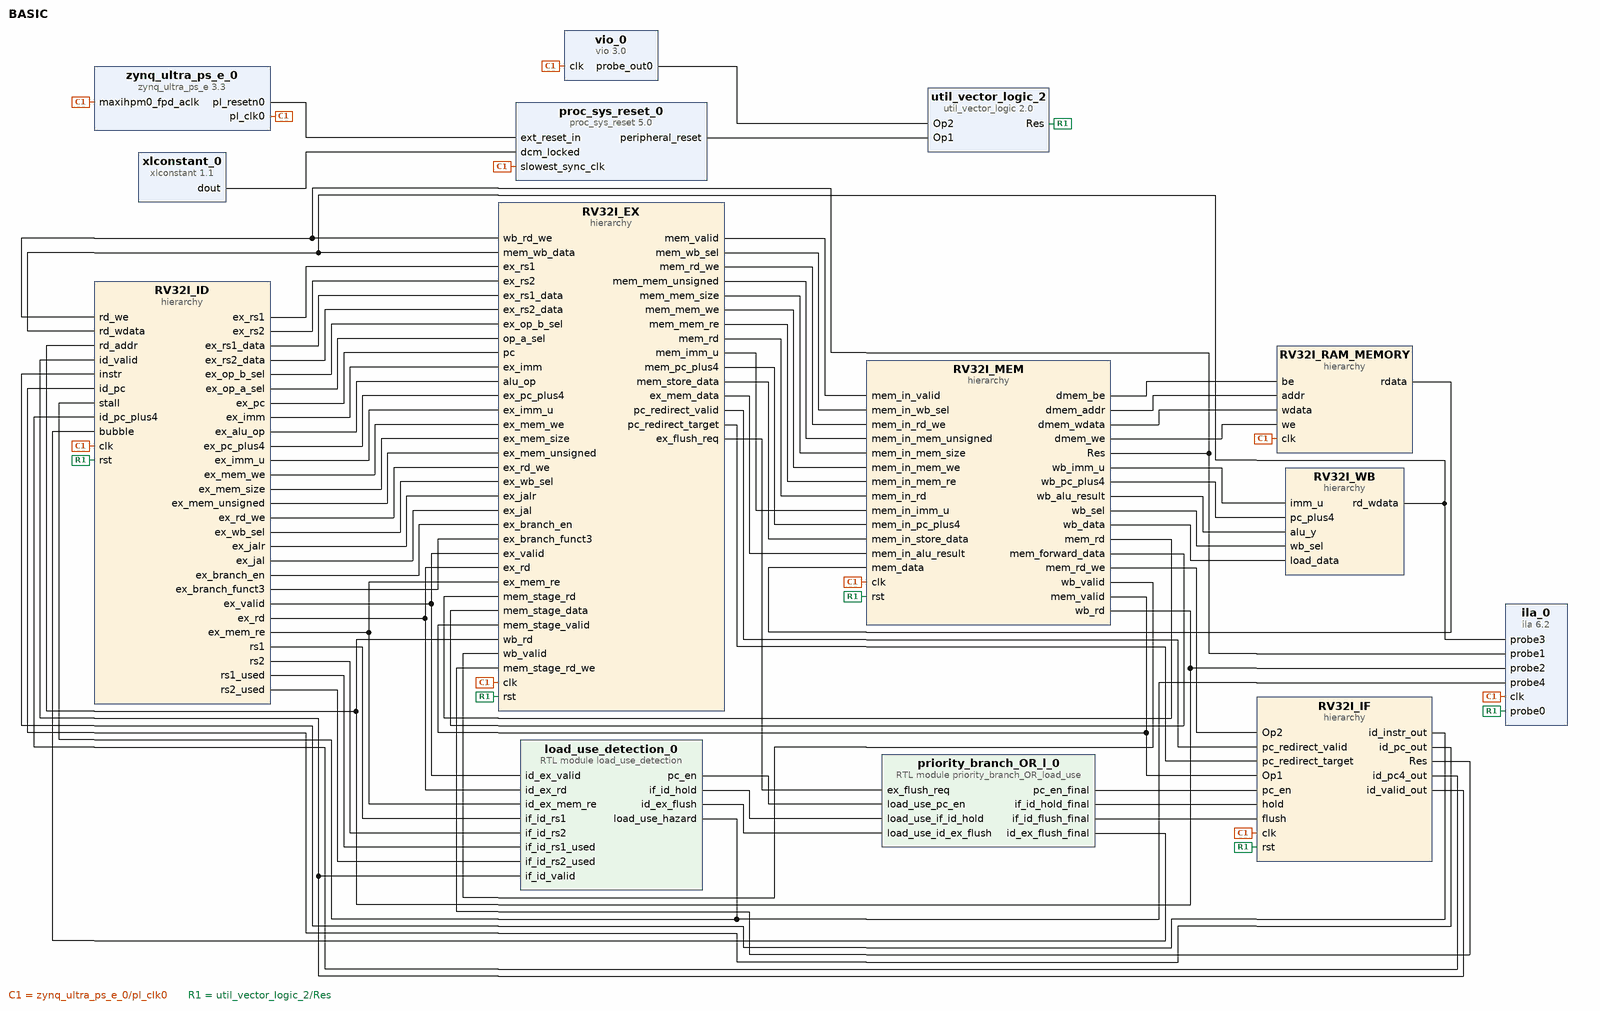
[diagram p0: block diagram of the top level]
# Vivado block design BASIC, xczu5ev-sfvc784-2-i, Vivado 2020.1
create_bd_design BASIC

create_bd_cell -type ip -vlnv xilinx.com:ip:zynq_ultra_ps_e:3.3 zynq_ultra_ps_e_0
set_property -dict [list \
  CONFIG.CAN0_BOARD_INTERFACE custom \
  CONFIG.CAN1_BOARD_INTERFACE custom \
  CONFIG.CSU_BOARD_INTERFACE custom \
  CONFIG.DP_BOARD_INTERFACE custom \
  CONFIG.GEM0_BOARD_INTERFACE custom \
  CONFIG.GEM1_BOARD_INTERFACE custom \
  CONFIG.GEM2_BOARD_INTERFACE custom \
  CONFIG.GEM3_BOARD_INTERFACE custom \
  CONFIG.GPIO_BOARD_INTERFACE custom \
  CONFIG.IIC0_BOARD_INTERFACE custom \
  CONFIG.IIC1_BOARD_INTERFACE custom \
  CONFIG.NAND_BOARD_INTERFACE custom \
  CONFIG.PCIE_BOARD_INTERFACE custom \
  CONFIG.PJTAG_BOARD_INTERFACE custom \
  CONFIG.PMU_BOARD_INTERFACE custom \
  CONFIG.PSU_BANK_0_IO_STANDARD LVCMOS18 \
  CONFIG.PSU_BANK_1_IO_STANDARD LVCMOS18 \
  CONFIG.PSU_BANK_2_IO_STANDARD LVCMOS18 \
  CONFIG.PSU_BANK_3_IO_STANDARD LVCMOS18 \
  CONFIG.PSU_USB3__DUAL_CLOCK_ENABLE 1 \
  CONFIG.PSU__CAN0__PERIPHERAL__ENABLE 1 \
  CONFIG.PSU__CAN0__PERIPHERAL__IO EMIO \
  CONFIG.PSU__CAN1__PERIPHERAL__ENABLE 0 \
  CONFIG.PSU__CRF_APB__ACPU_CTRL__FREQMHZ 1200 \
  CONFIG.PSU__CRF_APB__ACPU_CTRL__SRCSEL APLL \
  CONFIG.PSU__CRF_APB__APLL_CTRL__SRCSEL PSS_REF_CLK \
  CONFIG.PSU__CRF_APB__DBG_FPD_CTRL__FREQMHZ 250 \
  CONFIG.PSU__CRF_APB__DBG_FPD_CTRL__SRCSEL IOPLL \
  CONFIG.PSU__CRF_APB__DBG_TRACE_CTRL__FREQMHZ 250 \
  CONFIG.PSU__CRF_APB__DBG_TRACE_CTRL__SRCSEL IOPLL \
  CONFIG.PSU__CRF_APB__DBG_TSTMP_CTRL__FREQMHZ 250 \
  CONFIG.PSU__CRF_APB__DBG_TSTMP_CTRL__SRCSEL IOPLL \
  CONFIG.PSU__CRF_APB__DDR_CTRL__FREQMHZ 1200 \
  CONFIG.PSU__CRF_APB__DDR_CTRL__SRCSEL DPLL \
  CONFIG.PSU__CRF_APB__DPDMA_REF_CTRL__FREQMHZ 600 \
  CONFIG.PSU__CRF_APB__DPDMA_REF_CTRL__SRCSEL DPLL \
  CONFIG.PSU__CRF_APB__DPLL_CTRL__SRCSEL PSS_REF_CLK \
  CONFIG.PSU__CRF_APB__DP_AUDIO_REF_CTRL__SRCSEL RPLL \
  CONFIG.PSU__CRF_APB__DP_STC_REF_CTRL__SRCSEL RPLL \
  CONFIG.PSU__CRF_APB__DP_VIDEO_REF_CTRL__SRCSEL VPLL \
  CONFIG.PSU__CRF_APB__GDMA_REF_CTRL__FREQMHZ 600 \
  CONFIG.PSU__CRF_APB__GDMA_REF_CTRL__SRCSEL DPLL \
  CONFIG.PSU__CRF_APB__GPU_REF_CTRL__FREQMHZ 600 \
  CONFIG.PSU__CRF_APB__GPU_REF_CTRL__SRCSEL DPLL \
  CONFIG.PSU__CRF_APB__TOPSW_LSBUS_CTRL__FREQMHZ 100 \
  CONFIG.PSU__CRF_APB__TOPSW_LSBUS_CTRL__SRCSEL IOPLL \
  CONFIG.PSU__CRF_APB__TOPSW_MAIN_CTRL__FREQMHZ 533.333 \
  CONFIG.PSU__CRF_APB__TOPSW_MAIN_CTRL__SRCSEL DPLL \
  CONFIG.PSU__CRF_APB__VPLL_CTRL__SRCSEL PSS_REF_CLK \
  CONFIG.PSU__CRL_APB__ADMA_REF_CTRL__FREQMHZ 500 \
  CONFIG.PSU__CRL_APB__ADMA_REF_CTRL__SRCSEL IOPLL \
  CONFIG.PSU__CRL_APB__CAN1_REF_CTRL__FREQMHZ 100 \
  CONFIG.PSU__CRL_APB__CAN1_REF_CTRL__SRCSEL IOPLL \
  CONFIG.PSU__CRL_APB__CPU_R5_CTRL__FREQMHZ 500 \
  CONFIG.PSU__CRL_APB__CPU_R5_CTRL__SRCSEL IOPLL \
  CONFIG.PSU__CRL_APB__DBG_LPD_CTRL__FREQMHZ 250 \
  CONFIG.PSU__CRL_APB__DBG_LPD_CTRL__SRCSEL IOPLL \
  CONFIG.PSU__CRL_APB__GEM3_REF_CTRL__FREQMHZ 125 \
  CONFIG.PSU__CRL_APB__GEM3_REF_CTRL__SRCSEL IOPLL \
  CONFIG.PSU__CRL_APB__I2C0_REF_CTRL__FREQMHZ 100 \
  CONFIG.PSU__CRL_APB__I2C0_REF_CTRL__SRCSEL IOPLL \
  CONFIG.PSU__CRL_APB__I2C1_REF_CTRL__FREQMHZ 100 \
  CONFIG.PSU__CRL_APB__I2C1_REF_CTRL__SRCSEL IOPLL \
  CONFIG.PSU__CRL_APB__IOPLL_CTRL__SRCSEL PSS_REF_CLK \
  CONFIG.PSU__CRL_APB__IOU_SWITCH_CTRL__FREQMHZ 267 \
  CONFIG.PSU__CRL_APB__IOU_SWITCH_CTRL__SRCSEL RPLL \
  CONFIG.PSU__CRL_APB__LPD_LSBUS_CTRL__FREQMHZ 100 \
  CONFIG.PSU__CRL_APB__LPD_LSBUS_CTRL__SRCSEL IOPLL \
  CONFIG.PSU__CRL_APB__LPD_SWITCH_CTRL__FREQMHZ 500 \
  CONFIG.PSU__CRL_APB__LPD_SWITCH_CTRL__SRCSEL IOPLL \
  CONFIG.PSU__CRL_APB__PCAP_CTRL__FREQMHZ 200 \
  CONFIG.PSU__CRL_APB__PCAP_CTRL__SRCSEL IOPLL \
  CONFIG.PSU__CRL_APB__PL0_REF_CTRL__FREQMHZ 10 \
  CONFIG.PSU__CRL_APB__PL0_REF_CTRL__SRCSEL RPLL \
  CONFIG.PSU__CRL_APB__PL1_REF_CTRL__FREQMHZ 150 \
  CONFIG.PSU__CRL_APB__QSPI_REF_CTRL__FREQMHZ 300 \
  CONFIG.PSU__CRL_APB__QSPI_REF_CTRL__SRCSEL IOPLL \
  CONFIG.PSU__CRL_APB__RPLL_CTRL__SRCSEL PSS_REF_CLK \
  CONFIG.PSU__CRL_APB__SDIO1_REF_CTRL__FREQMHZ 200 \
  CONFIG.PSU__CRL_APB__SDIO1_REF_CTRL__SRCSEL RPLL \
  CONFIG.PSU__CRL_APB__TIMESTAMP_REF_CTRL__FREQMHZ 100 \
  CONFIG.PSU__CRL_APB__TIMESTAMP_REF_CTRL__SRCSEL PSS_REF_CLK \
  CONFIG.PSU__CRL_APB__UART0_REF_CTRL__FREQMHZ 100 \
  CONFIG.PSU__CRL_APB__UART0_REF_CTRL__SRCSEL IOPLL \
  CONFIG.PSU__CRL_APB__UART1_REF_CTRL__FREQMHZ 100 \
  CONFIG.PSU__CRL_APB__UART1_REF_CTRL__SRCSEL IOPLL \
  CONFIG.PSU__CRL_APB__USB0_BUS_REF_CTRL__FREQMHZ 250 \
  CONFIG.PSU__CRL_APB__USB0_BUS_REF_CTRL__SRCSEL IOPLL \
  CONFIG.PSU__CRL_APB__USB3_DUAL_REF_CTRL__FREQMHZ 20 \
  CONFIG.PSU__CRL_APB__USB3_DUAL_REF_CTRL__SRCSEL IOPLL \
  CONFIG.PSU__CRL_APB__USB3__ENABLE 1 \
  CONFIG.PSU__CSUPMU__PERIPHERAL__VALID 0 \
  CONFIG.PSU__DDRC__BUS_WIDTH {64 Bit} \
  CONFIG.PSU__DDRC__COMPONENTS Components \
  CONFIG.PSU__DDRC__DEVICE_CAPACITY {8192 MBits} \
  CONFIG.PSU__DDRC__DRAM_WIDTH {16 Bits} \
  CONFIG.PSU__DDRC__ECC Disabled \
  CONFIG.PSU__DDRC__MEMORY_TYPE {DDR 4} \
  CONFIG.PSU__DDRC__SPEED_BIN DDR4_2400R \
  CONFIG.PSU__DDR_HIGH_ADDRESS_GUI_ENABLE 1 \
  CONFIG.PSU__DDR__INTERFACE__FREQMHZ 600.000 \
  CONFIG.PSU__DEVICE_TYPE EV \
  CONFIG.PSU__DISPLAYPORT__LANE0__ENABLE 1 \
  CONFIG.PSU__DISPLAYPORT__LANE0__IO {GT Lane3} \
  CONFIG.PSU__DISPLAYPORT__LANE1__ENABLE 0 \
  CONFIG.PSU__DISPLAYPORT__PERIPHERAL__ENABLE 1 \
  CONFIG.PSU__DLL__ISUSED 1 \
  CONFIG.PSU__DPAUX__PERIPHERAL__ENABLE 1 \
  CONFIG.PSU__DPAUX__PERIPHERAL__IO {MIO 27 .. 30} \
  CONFIG.PSU__DP__LANE_SEL {Single Higher} \
  CONFIG.PSU__DP__REF_CLK_FREQ 108 \
  CONFIG.PSU__DP__REF_CLK_SEL {Ref Clk3} \
  CONFIG.PSU__ENET3__FIFO__ENABLE 0 \
  CONFIG.PSU__ENET3__GRP_MDIO__ENABLE 1 \
  CONFIG.PSU__ENET3__GRP_MDIO__IO {MIO 76 .. 77} \
  CONFIG.PSU__ENET3__PERIPHERAL__ENABLE 1 \
  CONFIG.PSU__ENET3__PERIPHERAL__IO {MIO 64 .. 75} \
  CONFIG.PSU__ENET3__PTP__ENABLE 0 \
  CONFIG.PSU__ENET3__TSU__ENABLE 0 \
  CONFIG.PSU__FPGA_PL0_ENABLE 1 \
  CONFIG.PSU__FPGA_PL1_ENABLE 1 \
  CONFIG.PSU__GEM3_COHERENCY 0 \
  CONFIG.PSU__GEM3_ROUTE_THROUGH_FPD 0 \
  CONFIG.PSU__GEM__TSU__ENABLE 0 \
  CONFIG.PSU__GPIO0_MIO__IO {MIO 0 .. 25} \
  CONFIG.PSU__GPIO0_MIO__PERIPHERAL__ENABLE 1 \
  CONFIG.PSU__GPIO1_MIO__IO {MIO 26 .. 51} \
  CONFIG.PSU__GPIO1_MIO__PERIPHERAL__ENABLE 1 \
  CONFIG.PSU__GPIO_EMIO_WIDTH 95 \
  CONFIG.PSU__GPIO_EMIO__PERIPHERAL__ENABLE 1 \
  CONFIG.PSU__GPIO_EMIO__PERIPHERAL__IO 95 \
  CONFIG.PSU__GT__LINK_SPEED HBR \
  CONFIG.PSU__GT__PRE_EMPH_LVL_4 0 \
  CONFIG.PSU__GT__VLT_SWNG_LVL_4 0 \
  CONFIG.PSU__I2C0__PERIPHERAL__ENABLE 1 \
  CONFIG.PSU__I2C0__PERIPHERAL__IO EMIO \
  CONFIG.PSU__I2C1__PERIPHERAL__ENABLE 1 \
  CONFIG.PSU__I2C1__PERIPHERAL__IO {MIO 24 .. 25} \
  CONFIG.PSU__IOU_SLCR__IOU_TTC_APB_CLK__TTC0_SEL APB \
  CONFIG.PSU__IOU_SLCR__IOU_TTC_APB_CLK__TTC1_SEL APB \
  CONFIG.PSU__IOU_SLCR__IOU_TTC_APB_CLK__TTC2_SEL APB \
  CONFIG.PSU__IOU_SLCR__IOU_TTC_APB_CLK__TTC3_SEL APB \
  CONFIG.PSU__LPD_SLCR__CSUPMU__FREQMHZ 100 \
  CONFIG.PSU__MAXIGP0__DATA_WIDTH 32 \
  CONFIG.PSU__OVERRIDE_HPX_QOS 0 \
  CONFIG.PSU__OVERRIDE__BASIC_CLOCK 0 \
  CONFIG.PSU__PMU__PERIPHERAL__ENABLE 0 \
  CONFIG.PSU__PRESET_APPLIED 0 \
  CONFIG.PSU__PSS_REF_CLK__FREQMHZ 33.333 \
  CONFIG.PSU__QSPI_COHERENCY 0 \
  CONFIG.PSU__QSPI_ROUTE_THROUGH_FPD 0 \
  CONFIG.PSU__QSPI__GRP_FBCLK__ENABLE 0 \
  CONFIG.PSU__QSPI__PERIPHERAL__DATA_MODE x4 \
  CONFIG.PSU__QSPI__PERIPHERAL__ENABLE 1 \
  CONFIG.PSU__QSPI__PERIPHERAL__IO {MIO 0 .. 12} \
  CONFIG.PSU__QSPI__PERIPHERAL__MODE {Dual Parallel} \
  CONFIG.PSU__SATA__LANE1__IO {GT Lane1} \
  CONFIG.PSU__SATA__PERIPHERAL__ENABLE 1 \
  CONFIG.PSU__SATA__REF_CLK_FREQ 125 \
  CONFIG.PSU__SATA__REF_CLK_SEL {Ref Clk1} \
  CONFIG.PSU__SD0__DATA_TRANSFER_MODE 8Bit \
  CONFIG.PSU__SD0__GRP_POW__ENABLE 1 \
  CONFIG.PSU__SD0__GRP_POW__IO {MIO 23} \
  CONFIG.PSU__SD0__PERIPHERAL__ENABLE 1 \
  CONFIG.PSU__SD0__PERIPHERAL__IO {MIO 13 .. 22} \
  CONFIG.PSU__SD0__RESET__ENABLE 1 \
  CONFIG.PSU__SD0__SLOT_TYPE eMMC \
  CONFIG.PSU__SD1_COHERENCY 0 \
  CONFIG.PSU__SD1_ROUTE_THROUGH_FPD 0 \
  CONFIG.PSU__SD1__DATA_TRANSFER_MODE 4Bit \
  CONFIG.PSU__SD1__GRP_CD__ENABLE 1 \
  CONFIG.PSU__SD1__GRP_CD__IO {MIO 45} \
  CONFIG.PSU__SD1__GRP_POW__ENABLE 0 \
  CONFIG.PSU__SD1__GRP_WP__ENABLE 1 \
  CONFIG.PSU__SD1__GRP_WP__IO {MIO 44} \
  CONFIG.PSU__SD1__PERIPHERAL__ENABLE 1 \
  CONFIG.PSU__SD1__PERIPHERAL__IO {MIO 46 .. 51} \
  CONFIG.PSU__SD1__SLOT_TYPE {SD 2.0} \
  CONFIG.PSU__SWDT0__CLOCK__ENABLE 0 \
  CONFIG.PSU__SWDT0__PERIPHERAL__ENABLE 1 \
  CONFIG.PSU__SWDT0__RESET__ENABLE 0 \
  CONFIG.PSU__SWDT1__CLOCK__ENABLE 0 \
  CONFIG.PSU__SWDT1__PERIPHERAL__ENABLE 1 \
  CONFIG.PSU__SWDT1__RESET__ENABLE 0 \
  CONFIG.PSU__TSU__BUFG_PORT_PAIR 0 \
  CONFIG.PSU__TTC0__CLOCK__ENABLE 0 \
  CONFIG.PSU__TTC0__PERIPHERAL__ENABLE 1 \
  CONFIG.PSU__TTC0__WAVEOUT__ENABLE 0 \
  CONFIG.PSU__TTC1__CLOCK__ENABLE 0 \
  CONFIG.PSU__TTC1__PERIPHERAL__ENABLE 1 \
  CONFIG.PSU__TTC1__WAVEOUT__ENABLE 0 \
  CONFIG.PSU__TTC2__CLOCK__ENABLE 0 \
  CONFIG.PSU__TTC2__PERIPHERAL__ENABLE 1 \
  CONFIG.PSU__TTC2__WAVEOUT__ENABLE 0 \
  CONFIG.PSU__TTC3__CLOCK__ENABLE 0 \
  CONFIG.PSU__TTC3__PERIPHERAL__ENABLE 1 \
  CONFIG.PSU__TTC3__WAVEOUT__ENABLE 0 \
  CONFIG.PSU__UART0__BAUD_RATE 115200 \
  CONFIG.PSU__UART0__MODEM__ENABLE 0 \
  CONFIG.PSU__UART0__PERIPHERAL__ENABLE 1 \
  CONFIG.PSU__UART0__PERIPHERAL__IO {MIO 34 .. 35} \
  CONFIG.PSU__UART1__PERIPHERAL__ENABLE 0 \
  CONFIG.PSU__USB0_COHERENCY 0 \
  CONFIG.PSU__USB0__PERIPHERAL__ENABLE 1 \
  CONFIG.PSU__USB0__PERIPHERAL__IO {MIO 52 .. 63} \
  CONFIG.PSU__USB0__REF_CLK_FREQ 52 \
  CONFIG.PSU__USB0__REF_CLK_SEL {Ref Clk2} \
  CONFIG.PSU__USB2_0__EMIO__ENABLE 0 \
  CONFIG.PSU__USB3_0__EMIO__ENABLE 0 \
  CONFIG.PSU__USB3_0__PERIPHERAL__ENABLE 1 \
  CONFIG.PSU__USB3_0__PERIPHERAL__IO {GT Lane2} \
  CONFIG.PSU__USB__RESET__MODE {Boot Pin} \
  CONFIG.PSU__USB__RESET__POLARITY {Active Low} \
  CONFIG.PSU__USE__IRQ0 0 \
  CONFIG.PSU__USE__M_AXI_GP0 1 \
  CONFIG.PSU__USE__M_AXI_GP1 0 \
  CONFIG.PSU__USE__M_AXI_GP2 0 \
  CONFIG.QSPI_BOARD_INTERFACE custom \
  CONFIG.SATA_BOARD_INTERFACE custom \
  CONFIG.SD0_BOARD_INTERFACE custom \
  CONFIG.SD1_BOARD_INTERFACE custom \
  CONFIG.SPI0_BOARD_INTERFACE custom \
  CONFIG.SPI1_BOARD_INTERFACE custom \
  CONFIG.SUBPRESET1 Custom \
  CONFIG.SUBPRESET2 Custom \
  CONFIG.SWDT0_BOARD_INTERFACE custom \
  CONFIG.SWDT1_BOARD_INTERFACE custom \
  CONFIG.TRACE_BOARD_INTERFACE custom \
  CONFIG.TTC0_BOARD_INTERFACE custom \
  CONFIG.TTC1_BOARD_INTERFACE custom \
  CONFIG.TTC2_BOARD_INTERFACE custom \
  CONFIG.TTC3_BOARD_INTERFACE custom \
  CONFIG.UART0_BOARD_INTERFACE custom \
  CONFIG.UART1_BOARD_INTERFACE custom \
  CONFIG.USB0_BOARD_INTERFACE custom \
  CONFIG.USB1_BOARD_INTERFACE custom \
] [get_bd_cells zynq_ultra_ps_e_0]
# 740 more settings of zynq_ultra_ps_e_0 are not shown: defaults, MIO pin electricals, DDR timing, and values the tool derives
create_bd_cell -type ip -vlnv xilinx.com:ip:proc_sys_reset:5.0 proc_sys_reset_0
create_bd_cell -type ip -vlnv xilinx.com:ip:xlconstant:1.1 xlconstant_0
create_bd_cell -type hier RV32I_IF
create_bd_cell -type hier RV32I_ID
create_bd_cell -type hier RV32I_EX
create_bd_cell -type hier RV32I_MEM
create_bd_cell -type hier RV32I_WB
create_bd_cell -type hier RV32I_RAM_MEMORY
create_bd_cell -type ip -vlnv xilinx.com:ip:ila:6.2 ila_0
set_property -dict [list \
  CONFIG.C_ENABLE_ILA_AXI_MON false \
  CONFIG.C_MONITOR_TYPE Native \
  CONFIG.C_NUM_OF_PROBES 5 \
  CONFIG.C_PROBE2_WIDTH 5 \
  CONFIG.C_PROBE3_WIDTH 32 \
] [get_bd_cells ila_0]
create_bd_cell -type ip -vlnv xilinx.com:ip:vio:3.0 vio_0
set_property -dict {CONFIG.C_NUM_PROBE_IN 0} [get_bd_cells vio_0]
create_bd_cell -type ip -vlnv xilinx.com:ip:util_vector_logic:2.0 util_vector_logic_2
set_property -dict {CONFIG.C_OPERATION or CONFIG.C_SIZE 1} [get_bd_cells util_vector_logic_2]
create_bd_cell -type module -reference load_use_detection load_use_detection_0
create_bd_cell -type module -reference priority_branch_OR_load_use priority_branch_OR_l_0

# ---- hierarchy /RV32I_IF ----
current_bd_instance /RV32I_IF
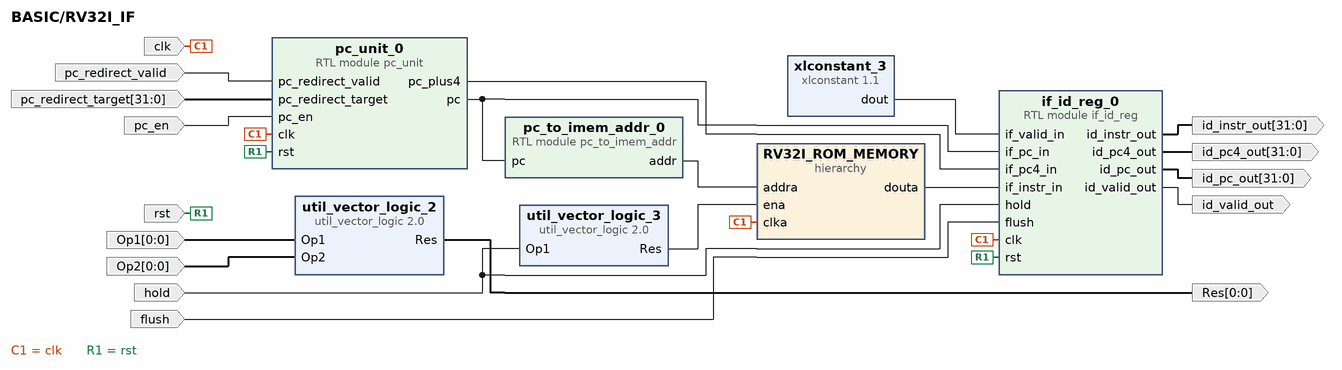
[diagram p1: block diagram inside /RV32I_IF]
create_bd_pin -dir I -from 0 -to 0 Op1
create_bd_pin -dir I -from 0 -to 0 Op2
create_bd_pin -dir O -from 0 -to 0 Res
create_bd_pin -dir I -type clk clk
create_bd_pin -dir I -type rst rst
create_bd_pin -dir I pc_redirect_valid
create_bd_pin -dir I -from 31 -to 0 pc_redirect_target
create_bd_pin -dir I flush
create_bd_pin -dir O -from 31 -to 0 id_pc_out
create_bd_pin -dir O -from 31 -to 0 id_pc4_out
create_bd_pin -dir O -from 31 -to 0 id_instr_out
create_bd_pin -dir O id_valid_out
create_bd_pin -dir I pc_en
create_bd_pin -dir I hold

create_bd_cell -type module -reference pc_to_imem_addr pc_to_imem_addr_0
set_property -dict {CONFIG.ADDR_W 11} [get_bd_cells pc_to_imem_addr_0]
create_bd_cell -type ip -vlnv xilinx.com:ip:util_vector_logic:2.0 util_vector_logic_2
set_property -dict {CONFIG.C_OPERATION and CONFIG.C_SIZE 1} [get_bd_cells util_vector_logic_2]
create_bd_cell -type ip -vlnv xilinx.com:ip:xlconstant:1.1 xlconstant_3
create_bd_cell -type module -reference pc_unit pc_unit_0
create_bd_cell -type hier RV32I_ROM_MEMORY
create_bd_cell -type module -reference if_id_reg if_id_reg_0
create_bd_cell -type ip -vlnv xilinx.com:ip:util_vector_logic:2.0 util_vector_logic_3
set_property -dict {CONFIG.C_OPERATION not CONFIG.C_SIZE 1} [get_bd_cells util_vector_logic_3]

# ---- hierarchy /RV32I_IF/RV32I_ROM_MEMORY ----
current_bd_instance /RV32I_IF/RV32I_ROM_MEMORY
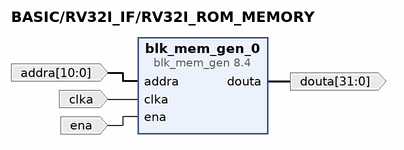
[diagram p2: block diagram inside /RV32I_IF/RV32I_ROM_MEMORY]
create_bd_pin -dir O -from 31 -to 0 douta
create_bd_pin -dir I -from 10 -to 0 addra
create_bd_pin -dir I ena
create_bd_pin -dir I -type clk clka

create_bd_cell -type ip -vlnv xilinx.com:ip:blk_mem_gen:8.4 blk_mem_gen_0
set_property -dict [list \
  CONFIG.Coe_File ../../../../../../../rv32i_vscode/prog_asm.coe \
  CONFIG.Enable_32bit_Address false \
  CONFIG.Fill_Remaining_Memory_Locations true \
  CONFIG.Load_Init_File true \
  CONFIG.Memory_Type Single_Port_ROM \
  CONFIG.Port_A_Write_Rate 0 \
  CONFIG.Register_PortA_Output_of_Memory_Primitives false \
  CONFIG.Use_RSTA_Pin false \
  CONFIG.Write_Depth_A 2048 \
  CONFIG.use_bram_block Stand_Alone \
] [get_bd_cells blk_mem_gen_0]

# ---- hierarchy /RV32I_ID ----
current_bd_instance /RV32I_ID
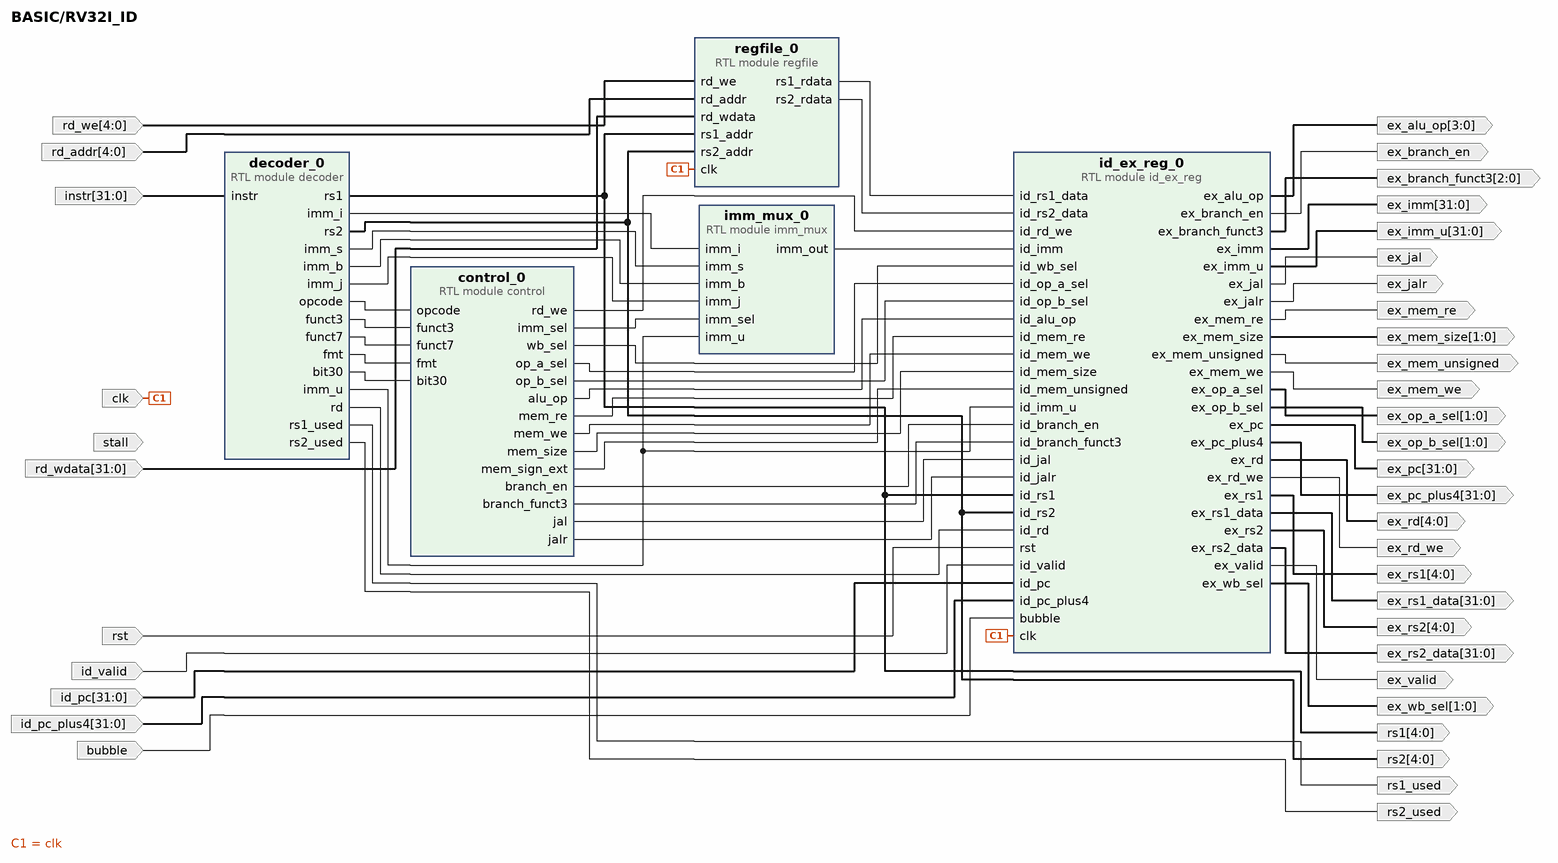
[diagram p3: block diagram inside /RV32I_ID]
create_bd_pin -dir I -type clk clk
create_bd_pin -dir I -from 4 -to 0 rd_we
create_bd_pin -dir I -from 4 -to 0 rd_addr
create_bd_pin -dir I -from 31 -to 0 rd_wdata
create_bd_pin -dir I -from 31 -to 0 instr
create_bd_pin -dir I -type rst rst
create_bd_pin -dir I bubble
create_bd_pin -dir I id_valid
create_bd_pin -dir I -from 31 -to 0 id_pc
create_bd_pin -dir I -from 31 -to 0 id_pc_plus4
create_bd_pin -dir O ex_valid
create_bd_pin -dir O -from 31 -to 0 ex_pc
create_bd_pin -dir O -from 31 -to 0 ex_pc_plus4
create_bd_pin -dir O -from 31 -to 0 ex_rs1_data
create_bd_pin -dir O -from 31 -to 0 ex_rs2_data
create_bd_pin -dir O -from 31 -to 0 ex_imm
create_bd_pin -dir O -from 31 -to 0 ex_imm_u
create_bd_pin -dir O -from 4 -to 0 ex_rs1
create_bd_pin -dir O -from 4 -to 0 ex_rs2
create_bd_pin -dir O -from 4 -to 0 ex_rd
create_bd_pin -dir O -from 3 -to 0 ex_alu_op
create_bd_pin -dir O -from 1 -to 0 ex_op_a_sel
create_bd_pin -dir O -from 1 -to 0 ex_op_b_sel
create_bd_pin -dir O ex_branch_en
create_bd_pin -dir O -from 2 -to 0 ex_branch_funct3
create_bd_pin -dir O ex_jal
create_bd_pin -dir O ex_jalr
create_bd_pin -dir O ex_mem_re
create_bd_pin -dir O ex_mem_we
create_bd_pin -dir O -from 1 -to 0 ex_mem_size
create_bd_pin -dir O ex_mem_unsigned
create_bd_pin -dir O ex_rd_we
create_bd_pin -dir O -from 1 -to 0 ex_wb_sel
create_bd_pin -dir O -from 4 -to 0 rs1
create_bd_pin -dir O -from 4 -to 0 rs2
create_bd_pin -dir I stall
create_bd_pin -dir O rs1_used
create_bd_pin -dir O rs2_used

create_bd_cell -type module -reference regfile regfile_0
create_bd_cell -type module -reference control control_0
create_bd_cell -type module -reference imm_mux imm_mux_0
create_bd_cell -type module -reference id_ex_reg id_ex_reg_0
create_bd_cell -type module -reference decoder decoder_0

# ---- hierarchy /RV32I_EX ----
current_bd_instance /RV32I_EX
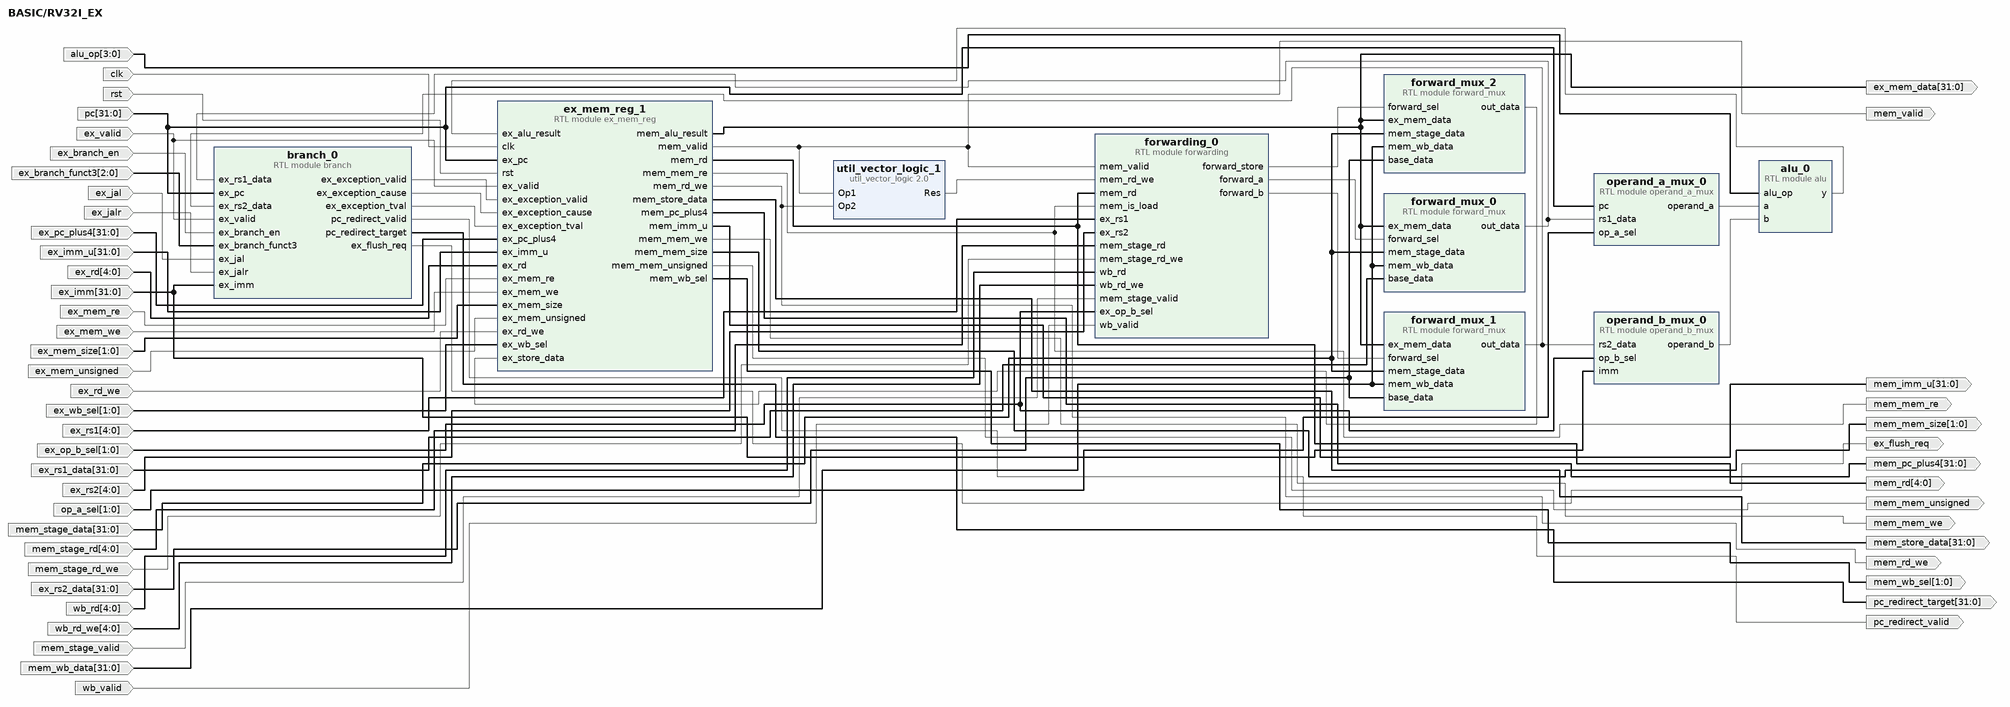
[diagram p4: block diagram inside /RV32I_EX]
create_bd_pin -dir I -from 3 -to 0 alu_op
create_bd_pin -dir I -type clk clk
create_bd_pin -dir I -type rst rst
create_bd_pin -dir I ex_valid
create_bd_pin -dir I -from 31 -to 0 pc
create_bd_pin -dir I -from 31 -to 0 ex_pc_plus4
create_bd_pin -dir I -from 31 -to 0 ex_imm_u
create_bd_pin -dir I -from 4 -to 0 ex_rd
create_bd_pin -dir I ex_mem_re
create_bd_pin -dir I ex_mem_we
create_bd_pin -dir I -from 1 -to 0 ex_mem_size
create_bd_pin -dir I ex_mem_unsigned
create_bd_pin -dir I ex_rd_we
create_bd_pin -dir I -from 1 -to 0 ex_wb_sel
create_bd_pin -dir O mem_valid
create_bd_pin -dir O -from 31 -to 0 ex_mem_data
create_bd_pin -dir O -from 31 -to 0 mem_store_data
create_bd_pin -dir O -from 31 -to 0 mem_pc_plus4
create_bd_pin -dir O -from 31 -to 0 mem_imm_u
create_bd_pin -dir O -from 4 -to 0 mem_rd
create_bd_pin -dir O mem_mem_re
create_bd_pin -dir O mem_mem_we
create_bd_pin -dir O -from 1 -to 0 mem_mem_size
create_bd_pin -dir O mem_mem_unsigned
create_bd_pin -dir O mem_rd_we
create_bd_pin -dir O -from 1 -to 0 mem_wb_sel
create_bd_pin -dir I -from 31 -to 0 ex_imm
create_bd_pin -dir I -from 1 -to 0 ex_op_b_sel
create_bd_pin -dir I -from 1 -to 0 op_a_sel
create_bd_pin -dir I -from 31 -to 0 ex_rs1_data
create_bd_pin -dir I -from 31 -to 0 mem_stage_data
create_bd_pin -dir I -from 31 -to 0 mem_wb_data
create_bd_pin -dir I -from 31 -to 0 ex_rs2_data
create_bd_pin -dir I -from 4 -to 0 ex_rs1
create_bd_pin -dir I -from 4 -to 0 ex_rs2
create_bd_pin -dir I -from 4 -to 0 mem_stage_rd
create_bd_pin -dir I mem_stage_rd_we
create_bd_pin -dir I -from 4 -to 0 wb_rd
create_bd_pin -dir I -from 4 -to 0 wb_rd_we
create_bd_pin -dir I ex_branch_en
create_bd_pin -dir I -from 2 -to 0 ex_branch_funct3
create_bd_pin -dir I ex_jal
create_bd_pin -dir I ex_jalr
create_bd_pin -dir O pc_redirect_valid
create_bd_pin -dir O -from 31 -to 0 pc_redirect_target
create_bd_pin -dir O ex_flush_req
create_bd_pin -dir I mem_stage_valid
create_bd_pin -dir I wb_valid

create_bd_cell -type module -reference alu alu_0
create_bd_cell -type module -reference ex_mem_reg ex_mem_reg_1
create_bd_cell -type module -reference operand_b_mux operand_b_mux_0
create_bd_cell -type module -reference operand_a_mux operand_a_mux_0
create_bd_cell -type module -reference forward_mux forward_mux_0
create_bd_cell -type module -reference forward_mux forward_mux_1
create_bd_cell -type module -reference branch branch_0
create_bd_cell -type ip -vlnv xilinx.com:ip:util_vector_logic:2.0 util_vector_logic_1
set_property -dict {CONFIG.C_OPERATION and CONFIG.C_SIZE 1} [get_bd_cells util_vector_logic_1]
create_bd_cell -type module -reference forward_mux forward_mux_2
create_bd_cell -type module -reference forwarding forwarding_0

# ---- hierarchy /RV32I_MEM ----
current_bd_instance /RV32I_MEM
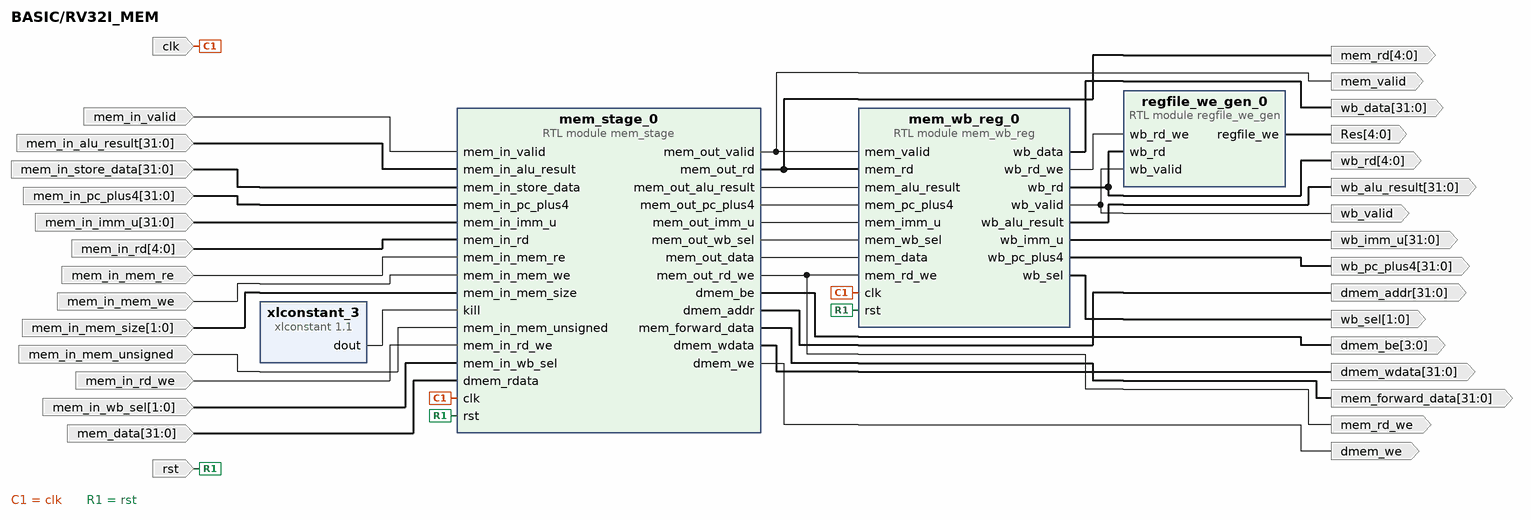
[diagram p5: block diagram inside /RV32I_MEM]
create_bd_pin -dir I -type clk clk
create_bd_pin -dir I -type rst rst
create_bd_pin -dir I mem_in_valid
create_bd_pin -dir I -from 31 -to 0 mem_in_alu_result
create_bd_pin -dir I -from 31 -to 0 mem_in_store_data
create_bd_pin -dir I -from 31 -to 0 mem_in_pc_plus4
create_bd_pin -dir I -from 31 -to 0 mem_in_imm_u
create_bd_pin -dir I -from 4 -to 0 mem_in_rd
create_bd_pin -dir I mem_in_mem_re
create_bd_pin -dir I mem_in_mem_we
create_bd_pin -dir I -from 1 -to 0 mem_in_mem_size
create_bd_pin -dir I mem_in_mem_unsigned
create_bd_pin -dir I mem_in_rd_we
create_bd_pin -dir I -from 1 -to 0 mem_in_wb_sel
create_bd_pin -dir O mem_valid
create_bd_pin -dir O -from 4 -to 0 mem_rd
create_bd_pin -dir O mem_rd_we
create_bd_pin -dir O -from 31 -to 0 mem_forward_data
create_bd_pin -dir O -from 31 -to 0 wb_data
create_bd_pin -dir O -from 31 -to 0 wb_alu_result
create_bd_pin -dir O -from 31 -to 0 wb_pc_plus4
create_bd_pin -dir O -from 31 -to 0 wb_imm_u
create_bd_pin -dir O -from 4 -to 0 wb_rd
create_bd_pin -dir O -from 1 -to 0 wb_sel
create_bd_pin -dir O -from 4 -to 0 Res
create_bd_pin -dir I -from 31 -to 0 mem_data
create_bd_pin -dir O -from 3 -to 0 dmem_be
create_bd_pin -dir O -from 31 -to 0 dmem_addr
create_bd_pin -dir O -from 31 -to 0 dmem_wdata
create_bd_pin -dir O dmem_we
create_bd_pin -dir O wb_valid

create_bd_cell -type module -reference mem_wb_reg mem_wb_reg_0
create_bd_cell -type module -reference regfile_we_gen regfile_we_gen_0
create_bd_cell -type ip -vlnv xilinx.com:ip:xlconstant:1.1 xlconstant_3
set_property -dict {CONFIG.CONST_VAL 0} [get_bd_cells xlconstant_3]
create_bd_cell -type module -reference mem_stage mem_stage_0

# ---- hierarchy /RV32I_WB ----
current_bd_instance /RV32I_WB
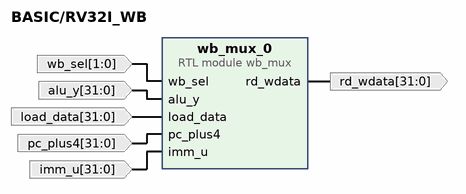
[diagram p6: block diagram inside /RV32I_WB]
create_bd_pin -dir I -from 1 -to 0 wb_sel
create_bd_pin -dir I -from 31 -to 0 alu_y
create_bd_pin -dir I -from 31 -to 0 load_data
create_bd_pin -dir I -from 31 -to 0 pc_plus4
create_bd_pin -dir I -from 31 -to 0 imm_u
create_bd_pin -dir O -from 31 -to 0 rd_wdata

create_bd_cell -type module -reference wb_mux wb_mux_0

# ---- hierarchy /RV32I_RAM_MEMORY ----
current_bd_instance /RV32I_RAM_MEMORY
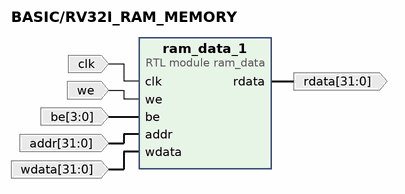
[diagram p7: block diagram inside /RV32I_RAM_MEMORY]
create_bd_pin -dir I -type clk clk
create_bd_pin -dir I we
create_bd_pin -dir I -from 3 -to 0 be
create_bd_pin -dir I -from 31 -to 0 addr
create_bd_pin -dir I -from 31 -to 0 wdata
create_bd_pin -dir O -from 31 -to 0 rdata

create_bd_cell -type module -reference ram_data ram_data_1

# ---- connections ----

current_bd_instance /RV32I_IF
connect_bd_net [get_bd_pins pc_unit_0/pc] [get_bd_pins pc_to_imem_addr_0/pc] [get_bd_pins if_id_reg_0/if_pc_in]
connect_bd_net [get_bd_pins xlconstant_3/dout] [get_bd_pins if_id_reg_0/if_valid_in]
connect_bd_net [get_bd_pins pc_unit_0/pc_plus4] [get_bd_pins if_id_reg_0/if_pc4_in]
connect_bd_net -net mem_stage_0_mem_out_valid [get_bd_pins Op1] [get_bd_pins util_vector_logic_2/Op1]
connect_bd_net -net mem_stage_0_mem_out_rd_we [get_bd_pins Op2] [get_bd_pins util_vector_logic_2/Op2]
connect_bd_net [get_bd_pins util_vector_logic_2/Res] [get_bd_pins Res]
connect_bd_net -net zynq_ultra_ps_e_0_pl_clk0 [get_bd_pins clk] \
  [get_bd_pins pc_unit_0/clk] [get_bd_pins RV32I_ROM_MEMORY/clka] [get_bd_pins if_id_reg_0/clk]
connect_bd_net -net proc_sys_reset_0_peripheral_reset [get_bd_pins rst] [get_bd_pins pc_unit_0/rst] [get_bd_pins if_id_reg_0/rst]
connect_bd_net -net branch_0_pc_redirect_valid [get_bd_pins pc_redirect_valid] [get_bd_pins pc_unit_0/pc_redirect_valid]
connect_bd_net -net branch_0_pc_redirect_target [get_bd_pins pc_redirect_target] [get_bd_pins pc_unit_0/pc_redirect_target]
connect_bd_net -net branch_0_ex_flush_req [get_bd_pins flush] [get_bd_pins if_id_reg_0/flush]
connect_bd_net [get_bd_pins if_id_reg_0/id_pc_out] [get_bd_pins id_pc_out]
connect_bd_net [get_bd_pins if_id_reg_0/id_pc4_out] [get_bd_pins id_pc4_out]
connect_bd_net [get_bd_pins if_id_reg_0/id_instr_out] [get_bd_pins id_instr_out]
connect_bd_net [get_bd_pins if_id_reg_0/id_valid_out] [get_bd_pins id_valid_out]
connect_bd_net [get_bd_pins pc_en] [get_bd_pins pc_unit_0/pc_en]
connect_bd_net [get_bd_pins hold] [get_bd_pins if_id_reg_0/hold] [get_bd_pins util_vector_logic_3/Op1]
connect_bd_net [get_bd_pins pc_to_imem_addr_0/addr] [get_bd_pins RV32I_ROM_MEMORY/addra]
connect_bd_net [get_bd_pins RV32I_ROM_MEMORY/douta] [get_bd_pins if_id_reg_0/if_instr_in]
connect_bd_net [get_bd_pins util_vector_logic_3/Res] [get_bd_pins RV32I_ROM_MEMORY/ena]

current_bd_instance /RV32I_IF/RV32I_ROM_MEMORY
connect_bd_net [get_bd_pins blk_mem_gen_0/douta] [get_bd_pins douta]
connect_bd_net -net RV32I_IF_addr [get_bd_pins addra] [get_bd_pins blk_mem_gen_0/addra]
connect_bd_net -net zynq_ultra_ps_e_0_pl_clk0 [get_bd_pins clka] [get_bd_pins blk_mem_gen_0/clka]
connect_bd_net -net RV32I_IF_dout [get_bd_pins ena] [get_bd_pins blk_mem_gen_0/ena]

current_bd_instance /RV32I_ID
connect_bd_net [get_bd_pins decoder_0/rs1] [get_bd_pins regfile_0/rs1_addr] [get_bd_pins id_ex_reg_0/id_rs1] [get_bd_pins rs1]
connect_bd_net [get_bd_pins decoder_0/rs2] [get_bd_pins regfile_0/rs2_addr] [get_bd_pins id_ex_reg_0/id_rs2] [get_bd_pins rs2]
connect_bd_net [get_bd_pins regfile_0/rs1_rdata] [get_bd_pins id_ex_reg_0/id_rs1_data]
connect_bd_net [get_bd_pins regfile_0/rs2_rdata] [get_bd_pins id_ex_reg_0/id_rs2_data]
connect_bd_net [get_bd_pins decoder_0/opcode] [get_bd_pins control_0/opcode]
connect_bd_net [get_bd_pins decoder_0/funct3] [get_bd_pins control_0/funct3]
connect_bd_net [get_bd_pins decoder_0/funct7] [get_bd_pins control_0/funct7]
connect_bd_net [get_bd_pins decoder_0/fmt] [get_bd_pins control_0/fmt]
connect_bd_net [get_bd_pins decoder_0/bit30] [get_bd_pins control_0/bit30]
connect_bd_net [get_bd_pins control_0/rd_we] [get_bd_pins id_ex_reg_0/id_rd_we]
connect_bd_net [get_bd_pins control_0/wb_sel] [get_bd_pins id_ex_reg_0/id_wb_sel]
connect_bd_net [get_bd_pins control_0/op_a_sel] [get_bd_pins id_ex_reg_0/id_op_a_sel]
connect_bd_net [get_bd_pins control_0/op_b_sel] [get_bd_pins id_ex_reg_0/id_op_b_sel]
connect_bd_net [get_bd_pins control_0/alu_op] [get_bd_pins id_ex_reg_0/id_alu_op]
connect_bd_net [get_bd_pins control_0/mem_re] [get_bd_pins id_ex_reg_0/id_mem_re]
connect_bd_net [get_bd_pins control_0/mem_we] [get_bd_pins id_ex_reg_0/id_mem_we]
connect_bd_net [get_bd_pins control_0/mem_size] [get_bd_pins id_ex_reg_0/id_mem_size]
connect_bd_net [get_bd_pins control_0/mem_sign_ext] [get_bd_pins id_ex_reg_0/id_mem_unsigned]
connect_bd_net [get_bd_pins control_0/branch_en] [get_bd_pins id_ex_reg_0/id_branch_en]
connect_bd_net [get_bd_pins control_0/branch_funct3] [get_bd_pins id_ex_reg_0/id_branch_funct3]
connect_bd_net [get_bd_pins control_0/jal] [get_bd_pins id_ex_reg_0/id_jal]
connect_bd_net [get_bd_pins control_0/jalr] [get_bd_pins id_ex_reg_0/id_jalr]
connect_bd_net [get_bd_pins control_0/imm_sel] [get_bd_pins imm_mux_0/imm_sel]
connect_bd_net [get_bd_pins decoder_0/imm_i] [get_bd_pins imm_mux_0/imm_i]
connect_bd_net [get_bd_pins decoder_0/imm_s] [get_bd_pins imm_mux_0/imm_s]
connect_bd_net [get_bd_pins decoder_0/imm_b] [get_bd_pins imm_mux_0/imm_b]
connect_bd_net [get_bd_pins decoder_0/imm_u] [get_bd_pins imm_mux_0/imm_u] [get_bd_pins id_ex_reg_0/id_imm_u]
connect_bd_net [get_bd_pins decoder_0/imm_j] [get_bd_pins imm_mux_0/imm_j]
connect_bd_net [get_bd_pins imm_mux_0/imm_out] [get_bd_pins id_ex_reg_0/id_imm]
connect_bd_net [get_bd_pins decoder_0/rd] [get_bd_pins id_ex_reg_0/id_rd]
connect_bd_net -net zynq_ultra_ps_e_0_pl_clk0 [get_bd_pins clk] [get_bd_pins id_ex_reg_0/clk] [get_bd_pins regfile_0/clk]
connect_bd_net -net util_vector_logic_0_Res [get_bd_pins rd_we] [get_bd_pins regfile_0/rd_we]
connect_bd_net -net mem_wb_reg_0_wb_rd [get_bd_pins rd_addr] [get_bd_pins regfile_0/rd_addr]
connect_bd_net -net wb_mux_0_rd_wdata [get_bd_pins rd_wdata] [get_bd_pins regfile_0/rd_wdata]
connect_bd_net -net if_id_reg_0_id_instr_out [get_bd_pins instr] [get_bd_pins decoder_0/instr]
connect_bd_net -net proc_sys_reset_0_peripheral_reset [get_bd_pins rst] [get_bd_pins id_ex_reg_0/rst]
connect_bd_net -net if_id_reg_0_id_valid_out [get_bd_pins id_valid] [get_bd_pins id_ex_reg_0/id_valid]
connect_bd_net -net if_id_reg_0_id_pc_out [get_bd_pins id_pc] [get_bd_pins id_ex_reg_0/id_pc]
connect_bd_net -net if_id_reg_0_id_pc4_out [get_bd_pins id_pc_plus4] [get_bd_pins id_ex_reg_0/id_pc_plus4]
connect_bd_net [get_bd_pins id_ex_reg_0/ex_valid] [get_bd_pins ex_valid]
connect_bd_net [get_bd_pins id_ex_reg_0/ex_pc] [get_bd_pins ex_pc]
connect_bd_net [get_bd_pins id_ex_reg_0/ex_pc_plus4] [get_bd_pins ex_pc_plus4]
connect_bd_net [get_bd_pins id_ex_reg_0/ex_rs1_data] [get_bd_pins ex_rs1_data]
connect_bd_net [get_bd_pins id_ex_reg_0/ex_rs2_data] [get_bd_pins ex_rs2_data]
connect_bd_net [get_bd_pins id_ex_reg_0/ex_imm] [get_bd_pins ex_imm]
connect_bd_net [get_bd_pins id_ex_reg_0/ex_imm_u] [get_bd_pins ex_imm_u]
connect_bd_net [get_bd_pins id_ex_reg_0/ex_rs1] [get_bd_pins ex_rs1]
connect_bd_net [get_bd_pins id_ex_reg_0/ex_rs2] [get_bd_pins ex_rs2]
connect_bd_net [get_bd_pins id_ex_reg_0/ex_rd] [get_bd_pins ex_rd]
connect_bd_net [get_bd_pins id_ex_reg_0/ex_alu_op] [get_bd_pins ex_alu_op]
connect_bd_net [get_bd_pins id_ex_reg_0/ex_op_a_sel] [get_bd_pins ex_op_a_sel]
connect_bd_net [get_bd_pins id_ex_reg_0/ex_op_b_sel] [get_bd_pins ex_op_b_sel]
connect_bd_net [get_bd_pins id_ex_reg_0/ex_branch_en] [get_bd_pins ex_branch_en]
connect_bd_net [get_bd_pins id_ex_reg_0/ex_branch_funct3] [get_bd_pins ex_branch_funct3]
connect_bd_net [get_bd_pins id_ex_reg_0/ex_jal] [get_bd_pins ex_jal]
connect_bd_net [get_bd_pins id_ex_reg_0/ex_jalr] [get_bd_pins ex_jalr]
connect_bd_net [get_bd_pins id_ex_reg_0/ex_mem_re] [get_bd_pins ex_mem_re]
connect_bd_net [get_bd_pins id_ex_reg_0/ex_mem_we] [get_bd_pins ex_mem_we]
connect_bd_net [get_bd_pins id_ex_reg_0/ex_mem_size] [get_bd_pins ex_mem_size]
connect_bd_net [get_bd_pins id_ex_reg_0/ex_mem_unsigned] [get_bd_pins ex_mem_unsigned]
connect_bd_net [get_bd_pins id_ex_reg_0/ex_rd_we] [get_bd_pins ex_rd_we]
connect_bd_net [get_bd_pins id_ex_reg_0/ex_wb_sel] [get_bd_pins ex_wb_sel]
connect_bd_net [get_bd_pins bubble] [get_bd_pins id_ex_reg_0/bubble]
connect_bd_net [get_bd_pins decoder_0/rs1_used] [get_bd_pins rs1_used]
connect_bd_net [get_bd_pins decoder_0/rs2_used] [get_bd_pins rs2_used]

current_bd_instance /RV32I_EX
connect_bd_net [get_bd_pins operand_a_mux_0/operand_a] [get_bd_pins alu_0/a]
connect_bd_net [get_bd_pins operand_b_mux_0/operand_b] [get_bd_pins alu_0/b]
connect_bd_net [get_bd_pins alu_0/y] [get_bd_pins ex_mem_reg_1/ex_alu_result]
connect_bd_net [get_bd_pins forward_mux_1/out_data] [get_bd_pins operand_b_mux_0/rs2_data] [get_bd_pins branch_0/ex_rs2_data]
connect_bd_net [get_bd_pins branch_0/ex_exception_valid] [get_bd_pins ex_mem_reg_1/ex_exception_valid]
connect_bd_net [get_bd_pins branch_0/ex_exception_cause] [get_bd_pins ex_mem_reg_1/ex_exception_cause]
connect_bd_net [get_bd_pins branch_0/ex_exception_tval] [get_bd_pins ex_mem_reg_1/ex_exception_tval]
connect_bd_net [get_bd_pins forward_mux_0/out_data] [get_bd_pins operand_a_mux_0/rs1_data] [get_bd_pins branch_0/ex_rs1_data]
connect_bd_net [get_bd_pins forwarding_0/forward_a] [get_bd_pins forward_mux_0/forward_sel]
connect_bd_net [get_bd_pins forwarding_0/forward_b] [get_bd_pins forward_mux_1/forward_sel]
connect_bd_net -net id_ex_reg_0_ex_alu_op [get_bd_pins alu_op] [get_bd_pins alu_0/alu_op]
connect_bd_net -net zynq_ultra_ps_e_0_pl_clk0 [get_bd_pins clk] [get_bd_pins ex_mem_reg_1/clk]
connect_bd_net -net proc_sys_reset_0_peripheral_reset [get_bd_pins rst] [get_bd_pins ex_mem_reg_1/rst]
connect_bd_net [get_bd_pins ex_valid] [get_bd_pins branch_0/ex_valid] [get_bd_pins ex_mem_reg_1/ex_valid]
connect_bd_net -net id_ex_reg_0_ex_pc [get_bd_pins pc] [get_bd_pins operand_a_mux_0/pc] [get_bd_pins branch_0/ex_pc] [get_bd_pins ex_mem_reg_1/ex_pc]
connect_bd_net -net id_ex_reg_0_ex_pc_plus4 [get_bd_pins ex_pc_plus4] [get_bd_pins ex_mem_reg_1/ex_pc_plus4]
connect_bd_net -net id_ex_reg_0_ex_imm_u [get_bd_pins ex_imm_u] [get_bd_pins ex_mem_reg_1/ex_imm_u]
connect_bd_net -net id_ex_reg_0_ex_rd [get_bd_pins ex_rd] [get_bd_pins ex_mem_reg_1/ex_rd]
connect_bd_net -net id_ex_reg_0_ex_mem_re [get_bd_pins ex_mem_re] [get_bd_pins ex_mem_reg_1/ex_mem_re]
connect_bd_net -net id_ex_reg_0_ex_mem_we [get_bd_pins ex_mem_we] [get_bd_pins ex_mem_reg_1/ex_mem_we]
connect_bd_net -net id_ex_reg_0_ex_mem_size [get_bd_pins ex_mem_size] [get_bd_pins ex_mem_reg_1/ex_mem_size]
connect_bd_net -net id_ex_reg_0_ex_mem_unsigned [get_bd_pins ex_mem_unsigned] [get_bd_pins ex_mem_reg_1/ex_mem_unsigned]
connect_bd_net -net id_ex_reg_0_ex_rd_we [get_bd_pins ex_rd_we] [get_bd_pins ex_mem_reg_1/ex_rd_we]
connect_bd_net -net id_ex_reg_0_ex_wb_sel [get_bd_pins ex_wb_sel] [get_bd_pins ex_mem_reg_1/ex_wb_sel]
connect_bd_net [get_bd_pins ex_mem_reg_1/mem_valid] [get_bd_pins mem_valid] [get_bd_pins util_vector_logic_1/Op1] [get_bd_pins forwarding_0/mem_valid]
connect_bd_net [get_bd_pins ex_mem_reg_1/mem_alu_result] \
  [get_bd_pins ex_mem_data] [get_bd_pins forward_mux_0/ex_mem_data] [get_bd_pins forward_mux_1/ex_mem_data] \
  [get_bd_pins forward_mux_2/ex_mem_data]
connect_bd_net [get_bd_pins ex_mem_reg_1/mem_store_data] [get_bd_pins mem_store_data]
connect_bd_net [get_bd_pins ex_mem_reg_1/mem_pc_plus4] [get_bd_pins mem_pc_plus4]
connect_bd_net [get_bd_pins ex_mem_reg_1/mem_imm_u] [get_bd_pins mem_imm_u]
connect_bd_net [get_bd_pins ex_mem_reg_1/mem_rd] [get_bd_pins mem_rd] [get_bd_pins forwarding_0/mem_rd]
connect_bd_net [get_bd_pins ex_mem_reg_1/mem_mem_re] [get_bd_pins mem_mem_re] [get_bd_pins forwarding_0/mem_is_load]
connect_bd_net [get_bd_pins ex_mem_reg_1/mem_mem_we] [get_bd_pins mem_mem_we]
connect_bd_net [get_bd_pins ex_mem_reg_1/mem_mem_size] [get_bd_pins mem_mem_size]
connect_bd_net [get_bd_pins ex_mem_reg_1/mem_mem_unsigned] [get_bd_pins mem_mem_unsigned]
connect_bd_net [get_bd_pins ex_mem_reg_1/mem_rd_we] [get_bd_pins mem_rd_we] [get_bd_pins util_vector_logic_1/Op2]
connect_bd_net [get_bd_pins ex_mem_reg_1/mem_wb_sel] [get_bd_pins mem_wb_sel]
connect_bd_net -net id_ex_reg_0_ex_imm [get_bd_pins ex_imm] [get_bd_pins branch_0/ex_imm] [get_bd_pins operand_b_mux_0/imm]
connect_bd_net -net id_ex_reg_0_ex_op_b_sel [get_bd_pins ex_op_b_sel] [get_bd_pins operand_b_mux_0/op_b_sel] [get_bd_pins forwarding_0/ex_op_b_sel]
connect_bd_net -net id_ex_reg_0_ex_op_a_sel [get_bd_pins op_a_sel] [get_bd_pins operand_a_mux_0/op_a_sel]
connect_bd_net -net id_ex_reg_0_ex_rs1_data [get_bd_pins ex_rs1_data] [get_bd_pins forward_mux_0/base_data]
connect_bd_net -net mem_stage_0_mem_forward_data [get_bd_pins mem_stage_data] \
  [get_bd_pins forward_mux_1/mem_stage_data] [get_bd_pins forward_mux_0/mem_stage_data] \
  [get_bd_pins forward_mux_2/mem_stage_data]
connect_bd_net -net id_ex_reg_0_ex_rs2_data [get_bd_pins ex_rs2_data] [get_bd_pins forward_mux_1/base_data] [get_bd_pins forward_mux_2/base_data]
connect_bd_net -net id_ex_reg_0_ex_rs1 [get_bd_pins ex_rs1] [get_bd_pins forwarding_0/ex_rs1]
connect_bd_net -net id_ex_reg_0_ex_rs2 [get_bd_pins ex_rs2] [get_bd_pins forwarding_0/ex_rs2]
connect_bd_net -net mem_stage_0_mem_out_rd [get_bd_pins mem_stage_rd] [get_bd_pins forwarding_0/mem_stage_rd]
connect_bd_net -net util_vector_logic_2_Res [get_bd_pins mem_stage_rd_we] [get_bd_pins forwarding_0/mem_stage_rd_we]
connect_bd_net -net mem_wb_reg_0_wb_rd [get_bd_pins wb_rd] [get_bd_pins forwarding_0/wb_rd]
connect_bd_net -net util_vector_logic_0_Res [get_bd_pins wb_rd_we] [get_bd_pins forwarding_0/wb_rd_we]
connect_bd_net -net id_ex_reg_0_ex_branch_en [get_bd_pins ex_branch_en] [get_bd_pins branch_0/ex_branch_en]
connect_bd_net -net id_ex_reg_0_ex_branch_funct3 [get_bd_pins ex_branch_funct3] [get_bd_pins branch_0/ex_branch_funct3]
connect_bd_net -net id_ex_reg_0_ex_jal [get_bd_pins ex_jal] [get_bd_pins branch_0/ex_jal]
connect_bd_net -net id_ex_reg_0_ex_jalr [get_bd_pins ex_jalr] [get_bd_pins branch_0/ex_jalr]
connect_bd_net [get_bd_pins branch_0/pc_redirect_valid] [get_bd_pins pc_redirect_valid]
connect_bd_net [get_bd_pins branch_0/pc_redirect_target] [get_bd_pins pc_redirect_target]
connect_bd_net [get_bd_pins branch_0/ex_flush_req] [get_bd_pins ex_flush_req]
connect_bd_net [get_bd_pins util_vector_logic_1/Res] [get_bd_pins forwarding_0/mem_rd_we]
connect_bd_net -net wb_mux_0_rd_wdata [get_bd_pins mem_wb_data] \
  [get_bd_pins forward_mux_1/mem_wb_data] [get_bd_pins forward_mux_0/mem_wb_data] [get_bd_pins forward_mux_2/mem_wb_data]
connect_bd_net [get_bd_pins forwarding_0/forward_store] [get_bd_pins forward_mux_2/forward_sel]
connect_bd_net [get_bd_pins forward_mux_2/out_data] [get_bd_pins ex_mem_reg_1/ex_store_data]
connect_bd_net [get_bd_pins mem_stage_valid] [get_bd_pins forwarding_0/mem_stage_valid]
connect_bd_net [get_bd_pins wb_valid] [get_bd_pins forwarding_0/wb_valid]

current_bd_instance /RV32I_MEM
connect_bd_net [get_bd_pins mem_stage_0/mem_out_alu_result] [get_bd_pins mem_wb_reg_0/mem_alu_result]
connect_bd_net [get_bd_pins mem_stage_0/mem_out_pc_plus4] [get_bd_pins mem_wb_reg_0/mem_pc_plus4]
connect_bd_net [get_bd_pins mem_stage_0/mem_out_imm_u] [get_bd_pins mem_wb_reg_0/mem_imm_u]
connect_bd_net [get_bd_pins mem_stage_0/mem_out_wb_sel] [get_bd_pins mem_wb_reg_0/mem_wb_sel]
connect_bd_net -net zynq_ultra_ps_e_0_pl_clk0 [get_bd_pins clk] [get_bd_pins mem_wb_reg_0/clk] [get_bd_pins mem_stage_0/clk]
connect_bd_net -net proc_sys_reset_0_peripheral_reset [get_bd_pins rst] [get_bd_pins mem_wb_reg_0/rst] [get_bd_pins mem_stage_0/rst]
connect_bd_net -net ex_mem_reg_1_mem_valid [get_bd_pins mem_in_valid] [get_bd_pins mem_stage_0/mem_in_valid]
connect_bd_net -net ex_mem_reg_1_mem_alu_result [get_bd_pins mem_in_alu_result] [get_bd_pins mem_stage_0/mem_in_alu_result]
connect_bd_net -net ex_mem_reg_1_mem_store_data [get_bd_pins mem_in_store_data] [get_bd_pins mem_stage_0/mem_in_store_data]
connect_bd_net -net ex_mem_reg_1_mem_pc_plus4 [get_bd_pins mem_in_pc_plus4] [get_bd_pins mem_stage_0/mem_in_pc_plus4]
connect_bd_net -net ex_mem_reg_1_mem_imm_u [get_bd_pins mem_in_imm_u] [get_bd_pins mem_stage_0/mem_in_imm_u]
connect_bd_net -net ex_mem_reg_1_mem_rd [get_bd_pins mem_in_rd] [get_bd_pins mem_stage_0/mem_in_rd]
connect_bd_net -net ex_mem_reg_1_mem_mem_re [get_bd_pins mem_in_mem_re] [get_bd_pins mem_stage_0/mem_in_mem_re]
connect_bd_net -net ex_mem_reg_1_mem_mem_we [get_bd_pins mem_in_mem_we] [get_bd_pins mem_stage_0/mem_in_mem_we]
connect_bd_net -net ex_mem_reg_1_mem_mem_size [get_bd_pins mem_in_mem_size] [get_bd_pins mem_stage_0/mem_in_mem_size]
connect_bd_net -net ex_mem_reg_1_mem_mem_unsigned [get_bd_pins mem_in_mem_unsigned] [get_bd_pins mem_stage_0/mem_in_mem_unsigned]
connect_bd_net -net ex_mem_reg_1_mem_rd_we [get_bd_pins mem_in_rd_we] [get_bd_pins mem_stage_0/mem_in_rd_we]
connect_bd_net -net ex_mem_reg_1_mem_wb_sel [get_bd_pins mem_in_wb_sel] [get_bd_pins mem_stage_0/mem_in_wb_sel]
connect_bd_net [get_bd_pins mem_stage_0/mem_out_valid] [get_bd_pins mem_valid] [get_bd_pins mem_wb_reg_0/mem_valid]
connect_bd_net [get_bd_pins mem_stage_0/mem_out_rd] [get_bd_pins mem_rd] [get_bd_pins mem_wb_reg_0/mem_rd]
connect_bd_net [get_bd_pins mem_stage_0/mem_out_rd_we] [get_bd_pins mem_rd_we] [get_bd_pins mem_wb_reg_0/mem_rd_we]
connect_bd_net [get_bd_pins mem_stage_0/mem_forward_data] [get_bd_pins mem_forward_data]
connect_bd_net [get_bd_pins mem_wb_reg_0/wb_data] [get_bd_pins wb_data]
connect_bd_net [get_bd_pins mem_wb_reg_0/wb_alu_result] [get_bd_pins wb_alu_result]
connect_bd_net [get_bd_pins mem_wb_reg_0/wb_pc_plus4] [get_bd_pins wb_pc_plus4]
connect_bd_net [get_bd_pins mem_wb_reg_0/wb_imm_u] [get_bd_pins wb_imm_u]
connect_bd_net [get_bd_pins mem_wb_reg_0/wb_rd] [get_bd_pins wb_rd] [get_bd_pins regfile_we_gen_0/wb_rd]
connect_bd_net [get_bd_pins mem_wb_reg_0/wb_sel] [get_bd_pins wb_sel]
connect_bd_net [get_bd_pins mem_stage_0/dmem_be] [get_bd_pins dmem_be]
connect_bd_net [get_bd_pins mem_stage_0/dmem_addr] [get_bd_pins dmem_addr]
connect_bd_net [get_bd_pins mem_stage_0/dmem_wdata] [get_bd_pins dmem_wdata]
connect_bd_net [get_bd_pins mem_stage_0/dmem_we] [get_bd_pins dmem_we]
connect_bd_net [get_bd_pins mem_stage_0/mem_out_data] [get_bd_pins mem_wb_reg_0/mem_data]
connect_bd_net [get_bd_pins mem_wb_reg_0/wb_valid] [get_bd_pins regfile_we_gen_0/wb_valid] [get_bd_pins wb_valid]
connect_bd_net [get_bd_pins mem_wb_reg_0/wb_rd_we] [get_bd_pins regfile_we_gen_0/wb_rd_we]
connect_bd_net [get_bd_pins regfile_we_gen_0/regfile_we] [get_bd_pins Res]
connect_bd_net [get_bd_pins mem_data] [get_bd_pins mem_stage_0/dmem_rdata]
connect_bd_net [get_bd_pins xlconstant_3/dout] [get_bd_pins mem_stage_0/kill]

current_bd_instance /RV32I_WB
connect_bd_net -net mem_wb_reg_0_wb_sel [get_bd_pins wb_sel] [get_bd_pins wb_mux_0/wb_sel]
connect_bd_net -net mem_wb_reg_0_wb_alu_result [get_bd_pins alu_y] [get_bd_pins wb_mux_0/alu_y]
connect_bd_net -net mem_wb_reg_0_wb_data [get_bd_pins load_data] [get_bd_pins wb_mux_0/load_data]
connect_bd_net -net mem_wb_reg_0_wb_pc_plus4 [get_bd_pins pc_plus4] [get_bd_pins wb_mux_0/pc_plus4]
connect_bd_net -net mem_wb_reg_0_wb_imm_u [get_bd_pins imm_u] [get_bd_pins wb_mux_0/imm_u]
connect_bd_net [get_bd_pins wb_mux_0/rd_wdata] [get_bd_pins rd_wdata]

current_bd_instance /RV32I_RAM_MEMORY
connect_bd_net -net zynq_ultra_ps_e_0_pl_clk0 [get_bd_pins clk] [get_bd_pins ram_data_1/clk]
connect_bd_net -net RV32I_MEM_dmem_we [get_bd_pins we] [get_bd_pins ram_data_1/we]
connect_bd_net -net RV32I_MEM_dmem_be [get_bd_pins be] [get_bd_pins ram_data_1/be]
connect_bd_net -net RV32I_MEM_dmem_addr [get_bd_pins addr] [get_bd_pins ram_data_1/addr]
connect_bd_net -net RV32I_MEM_dmem_wdata [get_bd_pins wdata] [get_bd_pins ram_data_1/wdata]
connect_bd_net [get_bd_pins ram_data_1/rdata] [get_bd_pins rdata]

current_bd_instance /
connect_bd_net [get_bd_pins zynq_ultra_ps_e_0/pl_clk0] \
  [get_bd_pins zynq_ultra_ps_e_0/maxihpm0_fpd_aclk] [get_bd_pins proc_sys_reset_0/slowest_sync_clk] \
  [get_bd_pins RV32I_IF/clk] [get_bd_pins RV32I_ID/clk] [get_bd_pins RV32I_EX/clk] [get_bd_pins RV32I_MEM/clk] \
  [get_bd_pins RV32I_RAM_MEMORY/clk] [get_bd_pins ila_0/clk] [get_bd_pins vio_0/clk]
connect_bd_net [get_bd_pins zynq_ultra_ps_e_0/pl_resetn0] [get_bd_pins proc_sys_reset_0/ext_reset_in]
connect_bd_net [get_bd_pins xlconstant_0/dout] [get_bd_pins proc_sys_reset_0/dcm_locked]
connect_bd_net -net proc_sys_reset_0_peripheral_reset [get_bd_pins util_vector_logic_2/Res] \
  [get_bd_pins RV32I_IF/rst] [get_bd_pins RV32I_ID/rst] [get_bd_pins RV32I_EX/rst] [get_bd_pins RV32I_MEM/rst] \
  [get_bd_pins ila_0/probe0]
connect_bd_net -net if_id_reg_0_id_instr_out [get_bd_pins RV32I_IF/id_instr_out] [get_bd_pins RV32I_ID/instr]
connect_bd_net -net if_id_reg_0_id_pc_out [get_bd_pins RV32I_IF/id_pc_out] [get_bd_pins RV32I_ID/id_pc]
connect_bd_net -net if_id_reg_0_id_pc4_out [get_bd_pins RV32I_IF/id_pc4_out] [get_bd_pins RV32I_ID/id_pc_plus4]
connect_bd_net -net if_id_reg_0_id_valid_out [get_bd_pins RV32I_IF/id_valid_out] \
  [get_bd_pins RV32I_ID/id_valid] [get_bd_pins load_use_detection_0/if_id_valid]
connect_bd_net -net id_ex_reg_0_ex_rs1 [get_bd_pins RV32I_ID/ex_rs1] [get_bd_pins RV32I_EX/ex_rs1]
connect_bd_net -net id_ex_reg_0_ex_rs2 [get_bd_pins RV32I_ID/ex_rs2] [get_bd_pins RV32I_EX/ex_rs2]
connect_bd_net -net id_ex_reg_0_ex_rs1_data [get_bd_pins RV32I_ID/ex_rs1_data] [get_bd_pins RV32I_EX/ex_rs1_data]
connect_bd_net -net id_ex_reg_0_ex_rs2_data [get_bd_pins RV32I_ID/ex_rs2_data] [get_bd_pins RV32I_EX/ex_rs2_data]
connect_bd_net -net id_ex_reg_0_ex_op_b_sel [get_bd_pins RV32I_ID/ex_op_b_sel] [get_bd_pins RV32I_EX/ex_op_b_sel]
connect_bd_net -net id_ex_reg_0_ex_op_a_sel [get_bd_pins RV32I_ID/ex_op_a_sel] [get_bd_pins RV32I_EX/op_a_sel]
connect_bd_net -net id_ex_reg_0_ex_pc [get_bd_pins RV32I_ID/ex_pc] [get_bd_pins RV32I_EX/pc]
connect_bd_net -net id_ex_reg_0_ex_imm [get_bd_pins RV32I_ID/ex_imm] [get_bd_pins RV32I_EX/ex_imm]
connect_bd_net -net id_ex_reg_0_ex_alu_op [get_bd_pins RV32I_ID/ex_alu_op] [get_bd_pins RV32I_EX/alu_op]
connect_bd_net [get_bd_pins RV32I_ID/ex_valid] [get_bd_pins RV32I_EX/ex_valid] [get_bd_pins load_use_detection_0/id_ex_valid]
connect_bd_net -net id_ex_reg_0_ex_pc_plus4 [get_bd_pins RV32I_ID/ex_pc_plus4] [get_bd_pins RV32I_EX/ex_pc_plus4]
connect_bd_net -net id_ex_reg_0_ex_imm_u [get_bd_pins RV32I_ID/ex_imm_u] [get_bd_pins RV32I_EX/ex_imm_u]
connect_bd_net -net id_ex_reg_0_ex_rd [get_bd_pins RV32I_ID/ex_rd] [get_bd_pins RV32I_EX/ex_rd] [get_bd_pins load_use_detection_0/id_ex_rd]
connect_bd_net -net id_ex_reg_0_ex_mem_re [get_bd_pins RV32I_ID/ex_mem_re] \
  [get_bd_pins RV32I_EX/ex_mem_re] [get_bd_pins load_use_detection_0/id_ex_mem_re]
connect_bd_net -net id_ex_reg_0_ex_mem_we [get_bd_pins RV32I_ID/ex_mem_we] [get_bd_pins RV32I_EX/ex_mem_we]
connect_bd_net -net id_ex_reg_0_ex_mem_size [get_bd_pins RV32I_ID/ex_mem_size] [get_bd_pins RV32I_EX/ex_mem_size]
connect_bd_net -net id_ex_reg_0_ex_mem_unsigned [get_bd_pins RV32I_ID/ex_mem_unsigned] [get_bd_pins RV32I_EX/ex_mem_unsigned]
connect_bd_net -net id_ex_reg_0_ex_rd_we [get_bd_pins RV32I_ID/ex_rd_we] [get_bd_pins RV32I_EX/ex_rd_we]
connect_bd_net -net id_ex_reg_0_ex_wb_sel [get_bd_pins RV32I_ID/ex_wb_sel] [get_bd_pins RV32I_EX/ex_wb_sel]
connect_bd_net -net branch_0_pc_redirect_valid [get_bd_pins RV32I_EX/pc_redirect_valid] [get_bd_pins RV32I_IF/pc_redirect_valid]
connect_bd_net -net branch_0_pc_redirect_target [get_bd_pins RV32I_EX/pc_redirect_target] [get_bd_pins RV32I_IF/pc_redirect_target]
connect_bd_net -net id_ex_reg_0_ex_jalr [get_bd_pins RV32I_ID/ex_jalr] [get_bd_pins RV32I_EX/ex_jalr]
connect_bd_net -net id_ex_reg_0_ex_jal [get_bd_pins RV32I_ID/ex_jal] [get_bd_pins RV32I_EX/ex_jal]
connect_bd_net -net id_ex_reg_0_ex_branch_en [get_bd_pins RV32I_ID/ex_branch_en] [get_bd_pins RV32I_EX/ex_branch_en]
connect_bd_net -net id_ex_reg_0_ex_branch_funct3 [get_bd_pins RV32I_ID/ex_branch_funct3] [get_bd_pins RV32I_EX/ex_branch_funct3]
connect_bd_net -net ex_mem_reg_1_mem_valid [get_bd_pins RV32I_EX/mem_valid] [get_bd_pins RV32I_MEM/mem_in_valid]
connect_bd_net -net ex_mem_reg_1_mem_wb_sel [get_bd_pins RV32I_EX/mem_wb_sel] [get_bd_pins RV32I_MEM/mem_in_wb_sel]
connect_bd_net -net ex_mem_reg_1_mem_rd_we [get_bd_pins RV32I_EX/mem_rd_we] [get_bd_pins RV32I_MEM/mem_in_rd_we]
connect_bd_net -net ex_mem_reg_1_mem_mem_unsigned [get_bd_pins RV32I_EX/mem_mem_unsigned] [get_bd_pins RV32I_MEM/mem_in_mem_unsigned]
connect_bd_net -net ex_mem_reg_1_mem_mem_size [get_bd_pins RV32I_EX/mem_mem_size] [get_bd_pins RV32I_MEM/mem_in_mem_size]
connect_bd_net -net ex_mem_reg_1_mem_mem_we [get_bd_pins RV32I_EX/mem_mem_we] [get_bd_pins RV32I_MEM/mem_in_mem_we]
connect_bd_net -net ex_mem_reg_1_mem_mem_re [get_bd_pins RV32I_EX/mem_mem_re] [get_bd_pins RV32I_MEM/mem_in_mem_re]
connect_bd_net -net ex_mem_reg_1_mem_rd [get_bd_pins RV32I_EX/mem_rd] [get_bd_pins RV32I_MEM/mem_in_rd]
connect_bd_net -net ex_mem_reg_1_mem_imm_u [get_bd_pins RV32I_EX/mem_imm_u] [get_bd_pins RV32I_MEM/mem_in_imm_u]
connect_bd_net -net ex_mem_reg_1_mem_pc_plus4 [get_bd_pins RV32I_EX/mem_pc_plus4] [get_bd_pins RV32I_MEM/mem_in_pc_plus4]
connect_bd_net -net ex_mem_reg_1_mem_store_data [get_bd_pins RV32I_EX/mem_store_data] [get_bd_pins RV32I_MEM/mem_in_store_data]
connect_bd_net -net ex_mem_reg_1_mem_alu_result [get_bd_pins RV32I_EX/ex_mem_data] [get_bd_pins RV32I_MEM/mem_in_alu_result]
connect_bd_net -net mem_stage_0_mem_out_rd_we [get_bd_pins RV32I_MEM/mem_rd_we] [get_bd_pins RV32I_IF/Op2]
connect_bd_net -net mem_stage_0_mem_out_valid [get_bd_pins RV32I_MEM/mem_valid] [get_bd_pins RV32I_IF/Op1] [get_bd_pins RV32I_EX/mem_stage_valid]
connect_bd_net -net mem_stage_0_mem_out_rd [get_bd_pins RV32I_MEM/mem_rd] [get_bd_pins RV32I_EX/mem_stage_rd]
connect_bd_net -net util_vector_logic_0_Res [get_bd_pins RV32I_MEM/Res] \
  [get_bd_pins RV32I_ID/rd_we] [get_bd_pins RV32I_EX/wb_rd_we] [get_bd_pins ila_0/probe1]
connect_bd_net -net mem_wb_reg_0_wb_imm_u [get_bd_pins RV32I_MEM/wb_imm_u] [get_bd_pins RV32I_WB/imm_u]
connect_bd_net -net mem_wb_reg_0_wb_pc_plus4 [get_bd_pins RV32I_MEM/wb_pc_plus4] [get_bd_pins RV32I_WB/pc_plus4]
connect_bd_net -net mem_wb_reg_0_wb_alu_result [get_bd_pins RV32I_MEM/wb_alu_result] [get_bd_pins RV32I_WB/alu_y]
connect_bd_net -net mem_wb_reg_0_wb_sel [get_bd_pins RV32I_MEM/wb_sel] [get_bd_pins RV32I_WB/wb_sel]
connect_bd_net -net mem_wb_reg_0_wb_data [get_bd_pins RV32I_MEM/wb_data] [get_bd_pins RV32I_WB/load_data]
connect_bd_net -net wb_mux_0_rd_wdata [get_bd_pins RV32I_WB/rd_wdata] \
  [get_bd_pins RV32I_ID/rd_wdata] [get_bd_pins RV32I_EX/mem_wb_data] [get_bd_pins ila_0/probe3]
connect_bd_net -net mem_wb_reg_0_wb_rd [get_bd_pins RV32I_MEM/wb_rd] \
  [get_bd_pins RV32I_ID/rd_addr] [get_bd_pins RV32I_EX/wb_rd] [get_bd_pins ila_0/probe2]
connect_bd_net -net mem_stage_0_mem_forward_data [get_bd_pins RV32I_MEM/mem_forward_data] [get_bd_pins RV32I_EX/mem_stage_data]
connect_bd_net -net util_vector_logic_2_Res [get_bd_pins RV32I_IF/Res] [get_bd_pins RV32I_EX/mem_stage_rd_we]
connect_bd_net [get_bd_pins RV32I_MEM/dmem_be] [get_bd_pins RV32I_RAM_MEMORY/be]
connect_bd_net [get_bd_pins RV32I_MEM/dmem_addr] [get_bd_pins RV32I_RAM_MEMORY/addr]
connect_bd_net [get_bd_pins RV32I_MEM/dmem_wdata] [get_bd_pins RV32I_RAM_MEMORY/wdata]
connect_bd_net [get_bd_pins RV32I_MEM/dmem_we] [get_bd_pins RV32I_RAM_MEMORY/we]
connect_bd_net [get_bd_pins load_use_detection_0/pc_en] [get_bd_pins priority_branch_OR_l_0/load_use_pc_en]
connect_bd_net [get_bd_pins load_use_detection_0/if_id_hold] [get_bd_pins priority_branch_OR_l_0/load_use_if_id_hold]
connect_bd_net [get_bd_pins priority_branch_OR_l_0/pc_en_final] [get_bd_pins RV32I_IF/pc_en]
connect_bd_net [get_bd_pins priority_branch_OR_l_0/if_id_hold_final] [get_bd_pins RV32I_IF/hold]
connect_bd_net [get_bd_pins priority_branch_OR_l_0/if_id_flush_final] [get_bd_pins RV32I_IF/flush]
connect_bd_net [get_bd_pins RV32I_EX/ex_flush_req] [get_bd_pins priority_branch_OR_l_0/ex_flush_req]
connect_bd_net [get_bd_pins priority_branch_OR_l_0/id_ex_flush_final] [get_bd_pins RV32I_ID/bubble]
connect_bd_net [get_bd_pins RV32I_ID/rs1] [get_bd_pins load_use_detection_0/if_id_rs1]
connect_bd_net [get_bd_pins RV32I_ID/rs2] [get_bd_pins load_use_detection_0/if_id_rs2]
connect_bd_net [get_bd_pins load_use_detection_0/id_ex_flush] [get_bd_pins priority_branch_OR_l_0/load_use_id_ex_flush]
connect_bd_net [get_bd_pins load_use_detection_0/load_use_hazard] [get_bd_pins ila_0/probe4] [get_bd_pins RV32I_ID/stall]
connect_bd_net [get_bd_pins proc_sys_reset_0/peripheral_reset] [get_bd_pins util_vector_logic_2/Op1]
connect_bd_net [get_bd_pins vio_0/probe_out0] [get_bd_pins util_vector_logic_2/Op2]
